# Altium schematic sheet HalfBridgeDriver.SchDoc
size A4; DocumentNumber: 5; SheetNumber: 3; SheetTotal: 15
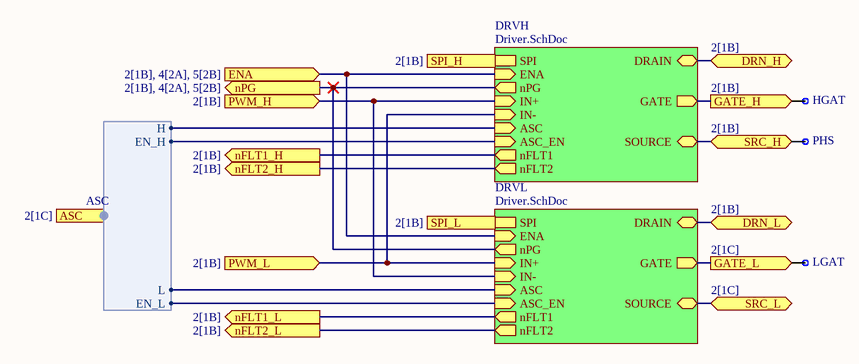
[diagram p0: HalfBridgeDriver.SchDoc]

## Parts
HGAT  Testpoint  [Testpoint-Footprint-1]  (value not drawn)  (no BOM)
LGAT  Testpoint  [Testpoint-Footprint-1]  (value not drawn)  (no BOM)
PHS  Testpoint  [Testpoint-Footprint-1]  (value not drawn)  (no BOM)

## Sub-sheets
DRVH = Driver.SchDoc: SPI (harness SPI), IN+ (in), IN- (in), ASC (in), ASC_EN (in), nFLT1 (out), nFLT2 (out), GATE (out), DRAIN (bidir), SOURCE (bidir), ENA (in), nPG (out)
DRVL = Driver.SchDoc: SPI (harness SPI), IN+ (in), IN- (in), ASC (in), ASC_EN (in), nFLT1 (out), nFLT2 (out), GATE (out), DRAIN (bidir), SOURCE (bidir), ENA (in), nPG (out)

## Ports
ASC (harness ASC, see 2[1C]), DRN_H (bidir, see 2[1B]), DRN_L (bidir, see 2[1B]), ENA (in, see 2[1B], 4[2A], 5[2B]), GATE_H (out, see 2[1B]), GATE_L (out, see 2[1C]), nFLT1_H (out, see 2[1B]), nFLT1_L (out, see 2[1B]), nFLT2_H (out, see 2[1B]), nFLT2_L (out, see 2[1B]), nPG (out, see 2[1B], 4[2A], 5[2B]), PWM_H (in, see 2[1B]), PWM_L (in, see 2[1B]), SPI_H (harness SPI, see 2[1B]), SPI_L (harness SPI, see 2[1B]), SRC_H (bidir, see 2[1B]), SRC_L (bidir, see 2[1C])

## Harnesses
ASC: H, EN_H, L, EN_L

## Nets
DRN_H: port DRN_H, sheet DRVH/DRAIN
DRN_L: port DRN_L, sheet DRVL/DRAIN
ENA: port ENA, sheet DRVH/ENA, sheet DRVL/ENA
GATE_H: HGAT.1 ; port GATE_H, sheet DRVH/GATE
GATE_L: LGAT.1 ; port GATE_L, sheet DRVL/GATE
nFLT1_H: port nFLT1_H, sheet DRVH/nFLT1
nFLT1_L: port nFLT1_L, sheet DRVL/nFLT1
nFLT2_H: port nFLT2_H, sheet DRVH/nFLT2
nFLT2_L: port nFLT2_L, sheet DRVL/nFLT2
nPG: port nPG, sheet DRVH/nPG, sheet DRVL/nPG
PWM_H: port PWM_H, sheet DRVH/IN+, sheet DRVL/IN-
PWM_L: port PWM_L, sheet DRVH/IN-, sheet DRVL/IN+
SRC_H: PHS.1 ; port SRC_H, sheet DRVH/SOURCE
SRC_L: port SRC_L, sheet DRVL/SOURCE
(unnamed): sheet DRVH/ASC, port ASC.H
(unnamed): sheet DRVH/ASC_EN, port ASC.EN_H
(unnamed): sheet DRVL/ASC, port ASC.L
(unnamed): sheet DRVL/ASC_EN, port ASC.EN_L

## Buses and harness runs
harness port SPI_H = sheet DRVH/SPI
harness port SPI_L = sheet DRVL/SPI

## Library data of the parts
HGAT LGAT PHS = CMP-003-000002-1